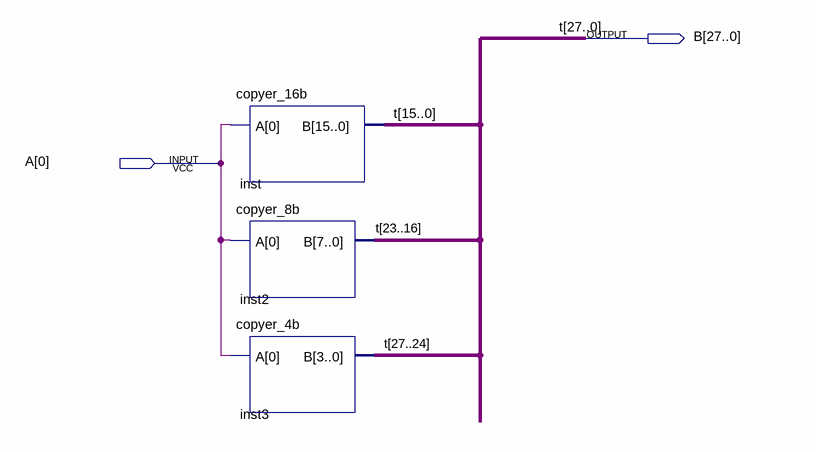
[diagram p0: schematic sheet]
// Quartus schematic copyer_28b.bdf as structural Verilog: 3 symbols, 2 pins
module copyer_28b (
  input  [0:0] A,
  output [27:0] B
);

  copyer_16b inst (.A(A[0]), .B(B[15:0]));
  copyer_8b inst2 (.A(A[0]), .B(B[23:16]));
  copyer_4b inst3 (.A(A[0]), .B(B[27:24]));

  // Other names for the same wires on the sheet: t[27:0] = B
endmodule
